# EAGLE schematic sample (EAGLE 7.5.0)
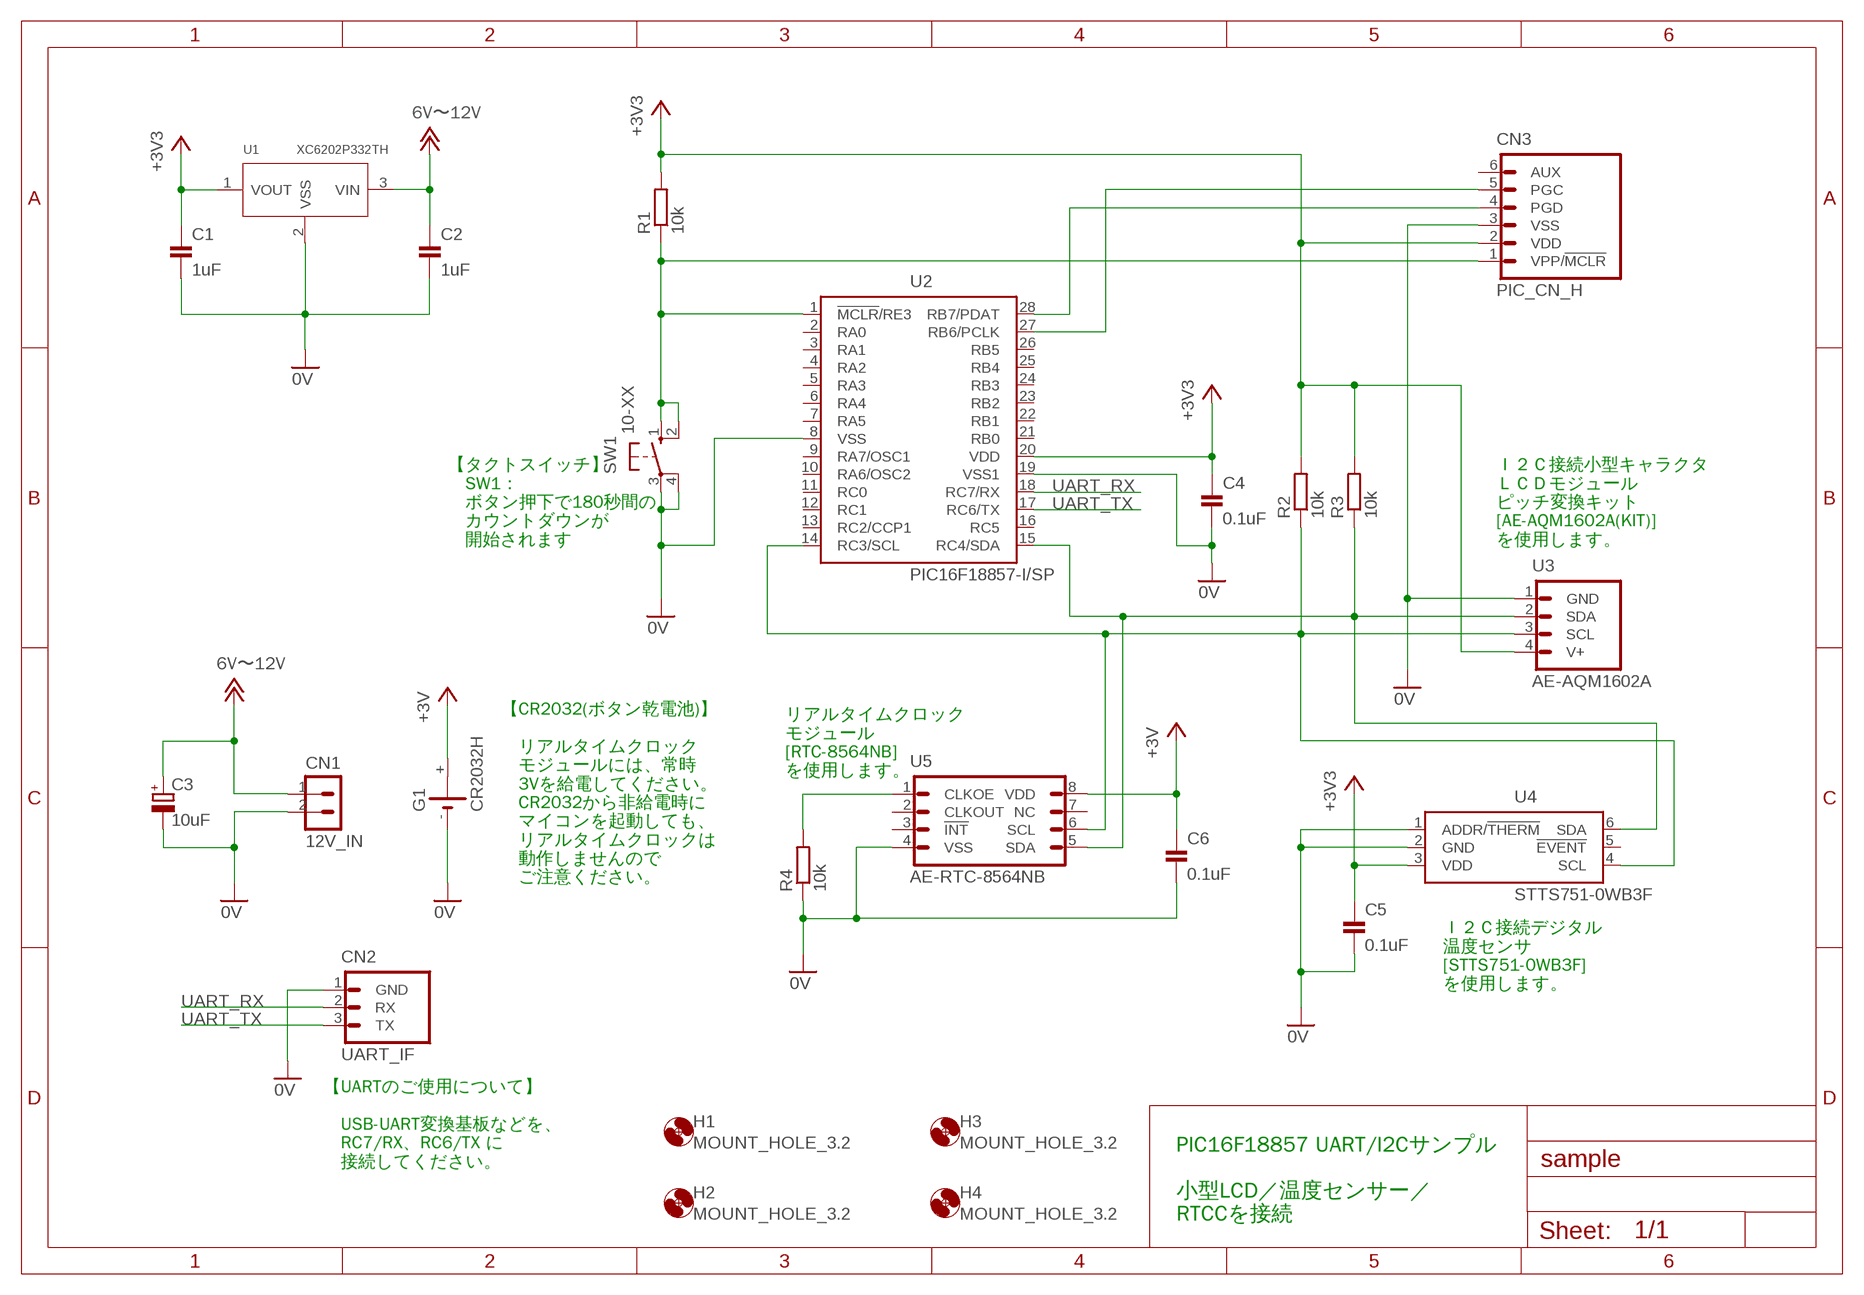
[diagram p0: schematic, sheet 1]

## Parts
C1  1uF  CAP_200MIL  [CAP_200MIL]
C2  1uF  CAP_200MIL  [CAP_200MIL]
C3  10uF  ELECAP_200MIL  [ELECAP_200MIL]
C4  0.1uF  CAP_200MIL  [CAP_200MIL]
C5  0.1uF  CAP_200MIL  [CAP_200MIL]
C6  0.1uF  CAP_200MIL  [CAP_200MIL]
CN1  12V_IN  CONN_2PIN-L  [HEADER_L_2PIN]
CN2  UART_IF  [UART_IF_3PIN]
CN3  PIC_CN_H  [HEADER_6PIN]
G1  CR2032H  [CR2032H]
H1  MOUNT_HOLE_3.2  [3,2]
H2  MOUNT_HOLE_3.2  [3,2]
H3  MOUNT_HOLE_3.2  [3,2]
H4  MOUNT_HOLE_3.2  [3,2]
R1  10k  RESISTOR_300MIL  [RESISTOR_0207_300MIL]
R2  10k  RESISTOR_300MIL  [RESISTOR_0207_300MIL]
R3  10k  RESISTOR_300MIL  [RESISTOR_0207_300MIL]
R4  10k  RESISTOR_300MIL  [RESISTOR_0207_300MIL]
SW1  10-XX  [B3F-10XX]
U1  XC6202P332TH  [TO92-LINE]
U2  PIC16F18857-I/SP  [DIL28-3]
U3  AE-AQM1602A  [AE-AQM1602A]
U4  STTS751-0WB3F  [SOT23-6L]
U5  AE-RTC-8564NB  [DIL8_AE-RTC-8564NB]

## Nets
0V: C1.2 C2.2 C3.- C4.2 C5.2 C6.2 CN1.2 CN2.1(GND) CN3.3(VSS) G1.- R4.1 SW1.3(P) SW1.4(P1) U1.2(VSS) U2.8(VSS) U2.19(VSS1) U3.1(GND) U4.1(ADDR/!THERM!) U4.2(GND) U5.4(VSS)
+3V: C6.1 G1.+ U5.8(VDD)
+3V3: C1.1 C4.1 C5.1 CN3.2(VDD) R1.2 R2.2 R3.2 U1.1(VOUT) U2.20(VDD) U3.4(V+) U4.3(VDD)
+12V: C2.1 C3.+ CN1.1 U1.3(VIN) ; supply symbol labelled 6V〜12V
N$1: R3.1 U2.15(RC4/SDA) U3.2(SDA) U4.6(SDA) U5.5(SDA)
N$2: CN3.4(PGD) U2.28(RB7/PDAT)
N$4: CN3.5(PGC) U2.27(RB6/PCLK)
N$6: R2.1 U2.14(RC3/SCL) U3.3(SCL) U4.4(SCL) U5.6(SCL)
N$8: R4.2 U5.1(CLKOE)
N$9: CN3.1(VPP/!MCLR) R1.1 SW1.1(S) SW1.2(S1) U2.1(!MCLR!/RE3)
UART_RX: CN2.2(RX) U2.18(RC7/RX)
UART_TX: CN2.3(TX) U2.17(RC6/TX)
Unconnected: CN3.6(AUX) G1.+@1(+) U2.2(RA0) U2.3(RA1) U2.4(RA2) U2.5(RA3) U2.6(RA4) U2.7(RA5) U2.9(RA7/OSC1) U2.10(RA6/OSC2) U2.11(RC0) U2.12(RC1) U2.13(RC2/CCP1) U2.16(RC5) U2.21(RB0) U2.22(RB1) U2.23(RB2) U2.24(RB3) U2.25(RB4) U2.26(RB5) U4.5(!EVENT!) U5.2(CLKOUT) U5.3(!INT!) U5.7(NC)

## Notes on the sheet
- 【タクトスイッチ】
  　SW1：
  　ボタン押下で180秒間の
  　カウントダウンが
  　開始されます
- Ｉ２Ｃ接続小型キャラクタ
  ＬＣＤモジュール
  ピッチ変換キット
  [AE-AQM1602A(KIT)]
  を使用します。
- リアルタイムクロック
  モジュール
  [RTC-8564NB]
  を使用します。
- 【CR2032(ボタン乾電池)】
  
  　リアルタイムクロック
  　モジュールには、常時
  　3Vを給電してください。
  　CR2032から非給電時に
  　マイコンを起動しても、
  　リアルタイムクロックは
  　動作しませんので
  　ご注意ください。
- Ｉ２Ｃ接続デジタル
  温度センサ
  [STTS751-0WB3F]
  を使用します。
- 【UARTのご使用について】
  
  　USB-UART変換基板などを、
  　RC7/RX、RC6/TX に
  　接続してください。
- PIC16F18857 UART/I2Cサンプル
  
  小型LCD／温度センサー／
  RTCCを接続

## Library data of the parts
C1 C2 C4-C6 = Parts:CAP: コンデンサー
C3 = Parts:ELECAP: 電解コンデンサー
CN1 = Connectors:CONN_2PIN
CN2 = PartsForProto:UART_IF: UART インターフェース
CN3 = Connectors:PIC_CN: PICKit 3 インターフェースピン
G1 = Parts:CR2032H: LI BATTERY Varta
H1-H4 = Generic:MOUNT_HOLE
R1-R4 = Parts:RESISTOR: 抵抗器
SW1 = Parts:10-XX: TACT SWITCH
U1 = Parts:XC6202*: 低損失ＣＭＯＳ三端子レギュレーター ・定格出力：５Ｖ ・最大出力電流：１５０ｍＡ以上 ・入力最大電圧：２０Ｖ ・入出力電圧差： ０．２Ｖ（３０ｍＡ時） ０．６７Ｖ（１００ｍＡ時） ・低消費電流：１０μＡ
U2 = Parts:PIC16F18857*: Full-Featured 28-Pin Microcontrollers ・プログラムメモリ：３２７６８ワード ・ＥＥＰＲＯＭ：２５６バイト ・データＳＲＡＭ：４０９６バイト ・Ｉ／Ｏ：最大２５ ・動作クロック：３２ＭＨｚ（最大） ・電源電圧：２．３Ｖ～５．５Ｖ ・２８ピンＤＩＰパッケージ
U3 = PartsForProto:AE-AQM1602A: LCDモジュール ピッチ変換キット Ｉ２Ｃ接続小型キャラクタＬＣＤモジュール AE-AQM1602A ◆６６ｍｍ×２７．７ｍｍ２．０ｍｍ （画面５４．７ｍｍｘ１０．８ｍｍ） ◆電源電圧は３．１～５．５Ｖ ◆低消費電流です：１ｍＡ＠３．３Ｖ
U4 = Parts:STTS751: 高精度１２ビットＩ２Ｃ接続デジタル温度センサ ・最大１２ビットの高分解能 ・温度測定精度 ±２℃ ・電源電圧：２．２５Ｖ～３．６Ｖ ・消費電流：５０μＡ ・インタフェース：Ｉ２Ｃ（２－Ｗｉｒｅ，ＳＭＢｕｓ） ・測定温度範囲：－４０℃～＋１２５℃ ・パッケージ：ＳＯＴ－２３－６
U5 = PartsForProto:AE-RTC-8564NB: リアルタイムクロック（ＲＴＣ）モジュール 宮崎エプソン（セイコーエプソン・エプソントヨコム）の リアルタイムクロックＩＣ（ＲＴＣ－８５６４ＮＢ）を 使ったクロックモジュールです。 秋月電子通商 <http://akizukidenshi.com/catalog/g/gI-00233/>